# Altium schematic sheet Sensors and Actuators.SchDoc: Sensors and Actuators
size Letter; Author: Alfredo Cortellini; Organization: IT Logic; Address1: 5753 Highway 85 N; Address2: Crestview, FL 32536; Address3: United States; DocumentNumber: 5; SheetNumber: 5; SheetTotal: 6; Email: pcb-design@itlogic.cloud
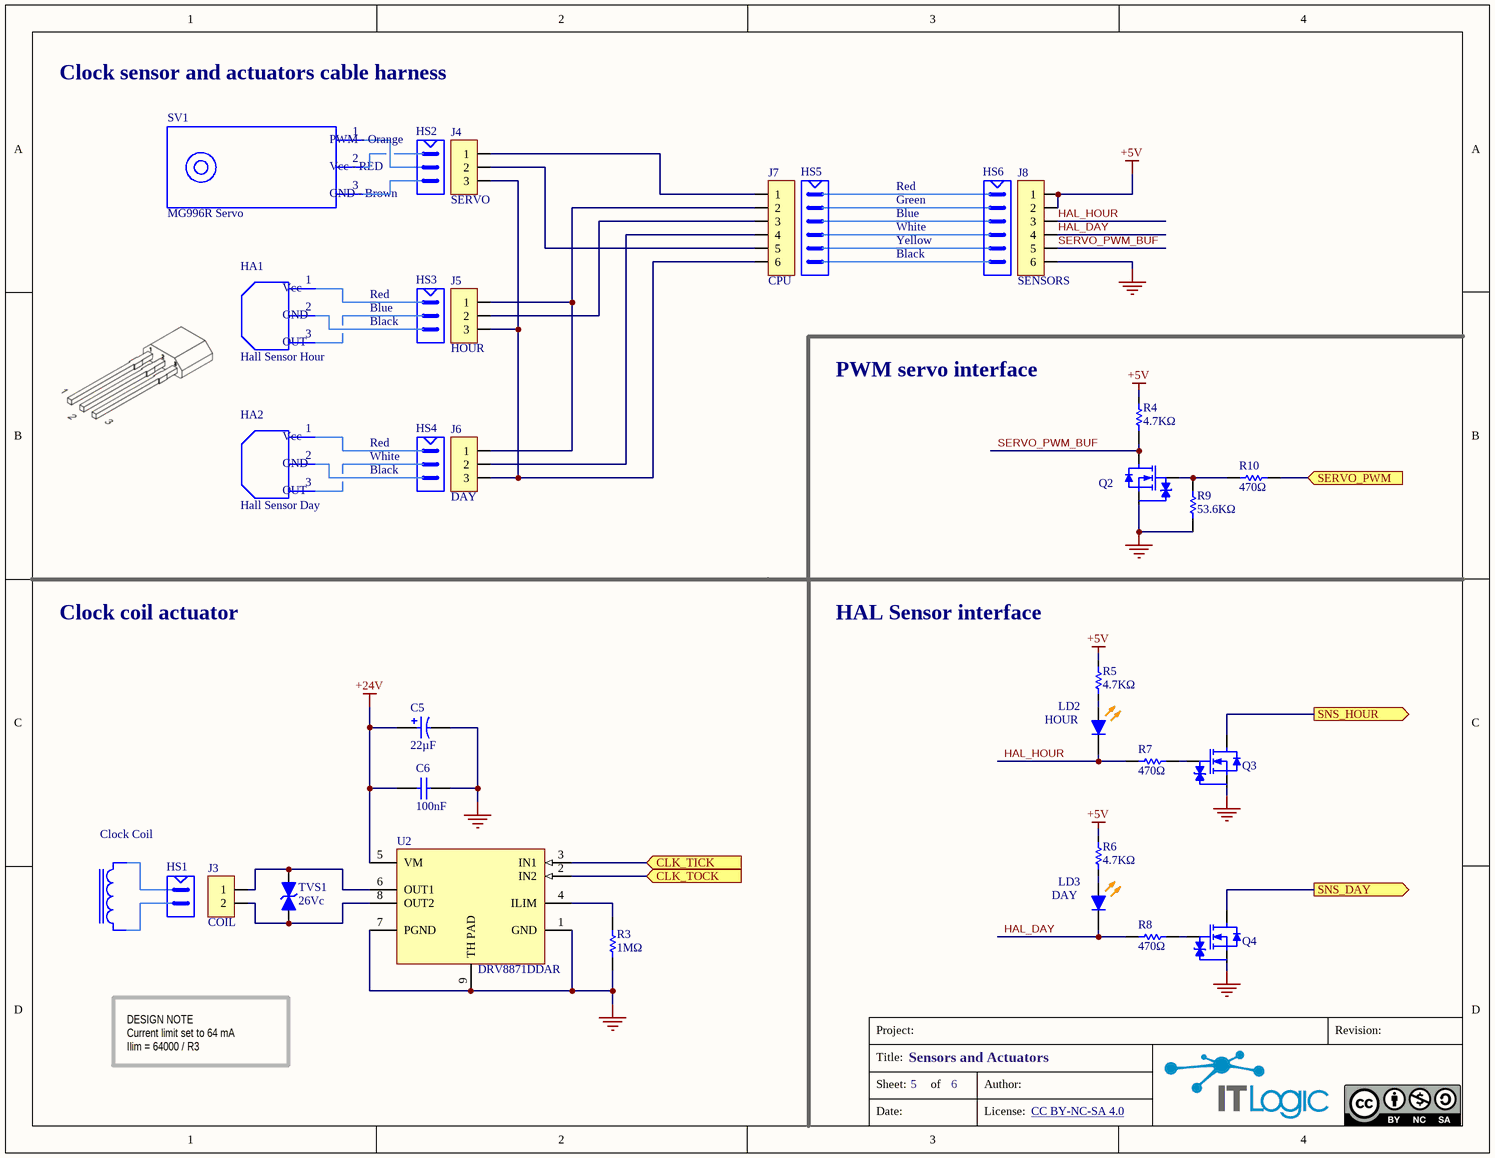
[diagram p0: Sensors and Actuators.SchDoc]

## Parts
C5  22µF  [C-AE-C6-H60]
C6  100nF  [C0603-H90]
HA1  Hall Sensor Hour  (mechanical)
HA2  Hall Sensor Day  (mechanical)
HS1  XHP-2  (value not drawn)  (mechanical)
HS2  XHP-3  (value not drawn)  (mechanical)
HS3  XHP-3  (value not drawn)  (mechanical)
HS4  XHP-3  (value not drawn)  (mechanical)
HS5  XHP-6  (value not drawn)  (mechanical)
HS6  XHP-6  (value not drawn)  (mechanical)
J3  COIL  [JST B2B-XH-A]
J4  SERVO  [JST B3B-XH-A]
J5  HOUR  [JST B3B-XH-A]
J6  DAY  [JST B3B-XH-A]
J7  CPU  [JST B6B-XH-A]
J8  SENSORS  [JST B6B-XH-A]
LD2  HOUR  [LED-0805-O]
LD3  DAY  [LED-0805-O]
Q2  BSS138K-13  [SOT-23]  (value not drawn)
Q3  BSS138K-13  [SOT-23]  (value not drawn)
Q4  BSS138K-13  [SOT-23]  (value not drawn)
R3  1MΩ  [R0603-H55]
R4  4.7KΩ  [R0603-H55]
R5  4.7KΩ  [R0603-H55]
R6  4.7KΩ  [R0603-H55]
R7  470Ω  [R0603-H55]
R8  470Ω  [R0603-H55]
R9  53.6KΩ  [R0603-H55]
R10  470Ω  [R0603-H55]
SV1  MG996R Servo  (mechanical)
TF1  SXH-001T-P0.6  (value not drawn)  (mechanical)
TF2  SXH-001T-P0.6  (value not drawn)  (mechanical)
TF3  SXH-001T-P0.6  (value not drawn)  (mechanical)
TF4  SXH-001T-P0.6  (value not drawn)  (mechanical)
TF5  SXH-001T-P0.6  (value not drawn)  (mechanical)
TF6  SXH-001T-P0.6  (value not drawn)  (mechanical)
TF7  SXH-001T-P0.6  (value not drawn)  (mechanical)
TF8  SXH-001T-P0.6  (value not drawn)  (mechanical)
TF9  SXH-001T-P0.6  (value not drawn)  (mechanical)
TF10  SXH-001T-P0.6  (value not drawn)  (mechanical)
TF11  SXH-001T-P0.6  (value not drawn)  (mechanical)
TF12  SXH-001T-P0.6  (value not drawn)  (mechanical)
TF13  SXH-001T-P0.6  (value not drawn)  (mechanical)
TF14  SXH-001T-P0.6  (value not drawn)  (mechanical)
TF15  SXH-001T-P0.6  (value not drawn)  (mechanical)
TF16  SXH-001T-P0.6  (value not drawn)  (mechanical)
TF17  SXH-001T-P0.6  (value not drawn)  (mechanical)
TF18  SXH-001T-P0.6  (value not drawn)  (mechanical)
TF19  SXH-001T-P0.6  (value not drawn)  (mechanical)
TF20  SXH-001T-P0.6  (value not drawn)  (mechanical)
TF21  SXH-001T-P0.6  (value not drawn)  (mechanical)
TF22  SXH-001T-P0.6  (value not drawn)  (mechanical)
TF23  SXH-001T-P0.6  (value not drawn)  (mechanical)
TVS1  26Vc  [DO-214AC-SMA-NO POL]
U2  DRV8871DDAR  [SOIC-8-N-HT]

## Ports
CLK_TICK (in), CLK_TOCK (in), SERVO_PWM (in), SNS_DAY (out), SNS_HOUR (out)

## Nets
+5V: J8.1 J8.2 R4.2 R5.2 R6.2
+24V: C5.1 C6.1 U2.5(VM)
GND: C5.2 C6.2 J8.6 Q2.2(S) Q3.2(S) Q4.2(S) R3.1 R9.1 U2.1(GND) U2.7(PGND) U2.9(TH_PAD)
CLK_TICK: U2.3(IN1) ; port CLK_TICK
CLK_TOCK: U2.2(IN2) ; port CLK_TOCK
HAL_DAY: J8.4 LD3.1(K) R8.1
HAL_HOUR: J8.3 LD2.1(K) R7.1
SERVO_PWM: R10.2 ; port SERVO_PWM
SERVO_PWM_BUF: J8.5 Q2.3(D) R4.1
SNS_DAY: Q4.3(D) ; port SNS_DAY
SNS_HOUR: Q3.3(D) ; port SNS_HOUR
NetJ3_1: J3.1 TVS1.2 U2.6(OUT1)
NetJ3_2: J3.2 TVS1.1 U2.8(OUT2)
NetJ4_1: J4.1 J7.1
NetJ4_2: J4.2 J7.5
NetJ4_3: J4.3 J5.3 J6.3 J7.6
NetJ5_1: J5.1 J6.1 J7.2
NetJ5_2: J5.2 J7.3
NetJ6_2: J6.2 J7.4
NetLD2_2: LD2.2(A) R5.1
NetLD3_2: LD3.2(A) R6.1
NetQ2_1: Q2.1(G) R9.2 R10.1
NetQ3_1: Q3.1(G) R7.2
NetQ4_1: Q4.1(G) R8.2
NetR3_2: R3.2 U2.4(ILIM)

## Notes on the sheet
- Clock sensor and actuators cable harness
- Blue
- Red
- Green
- White
- Black
- Yellow
- PWM servo interface
- Clock coil actuator
- HAL Sensor interface
- Clock Coil
- DESIGN NOTE
  Current limit set to 64 mA
  Ilim = 64000 / R3
- Project:
- Revision:
- Title:
- Sheet:
- of
- Author:
- Date:
- License:
- CC BY-NC-SA 4.0 <https://creativecommons.org/licenses/by-nc-sa/4.0/>
- (in symbol DRV5023AJQLPG_MEC) 1; Vcc; 2; GND; 3; OUT
- (in symbol MG996R) 1; PWM - Orange; 2; Vcc - RED; 3; GND - Brown

## Library data of the parts
C5 = EEE-FK1H220P: Cap Electrolytic Alu 22uF 50V 20% 165mA 2000h 105C Automotive, Case D; Manufacturer: Panasonic; Resistance: 0.88R; Value: 22u; Manufacturer Part Number: EEE-FK1H220P; Mount: Surface Mount; Capacitance: 22uF; Voltage Rating: 50V; ComponentLink1URL: https://datasheet.ciiva.com/3773/41677623s8437994n1386-3773397.pdf; ComponentLink1Description: Data Sheet; Case: D
C6 = CGA3E2X7R1H104K080AA: Cap 0603 Case Ceramic 100nF 50V X7R; Manufacturer: TDK; Value: 100n; Manufacturer Part Number: CGA3E2X7R1H104K080AA; Mount: Surface Mount; Case: 0603; Capacitance: 100nF; Dielectric: X7R; Voltage Rating: 50V; ComponentLink1URL: https://product.tdk.com/system/files/dam/doc/product/capacitor/ceramic/mlcc/catalog/mlcc_commercial_general_en.pdf; ComponentLink1Description: Data Sheet
HA1 HA2 = DRV5023AJQLPG_MEC: Hall Effect/Magnetic Sensors 2.5 to 38 V 3-TO-92; Manufacturer: Texas Instruments; Manufacturer Part Number: DRV5023AJQLPG; Case: TO-92; ComponentLink1URL: https://www.ti.com/lit/ds/symlink/drv5023.pdf?ts=1619282643269&ref_url=https%253A%252F%252Fwww.ti.com%252Fsensors%252Fmagnetic-sensors%252Fhall-effect-latches-switches%252Fproducts.html; ComponentLink1Description: Data Sheet; Mount: Through Hole
HS1 = XHP-2: Conn Crimp Housing, Series JST XH, 2 Circuits; Current Rating: 3A; Voltage Rating: 250V; Manufacturer: JST; Manufacturer Part Number: XHP-2; Mount: Free Hanging; ComponentLink1URL: https://www.mouser.com/datasheet/2/276/0050579404_CRIMP_HOUSINGS-160468.pdf; ComponentLink1Description: Data Sheet
HS2-HS4 = XHP-3: Conn Crimp Housing, Series JST XH, 3 Circuits; Current Rating: 3A; Voltage Rating: 250V; Manufacturer: JST; Manufacturer Part Number: XHP-3; Mount: Free Hanging; ComponentLink1URL: https://www.mouser.com/datasheet/2/276/0050579404_CRIMP_HOUSINGS-160468.pdf; ComponentLink1Description: Data Sheet
HS5 HS6 = XHP-6: Conn Crimp Housing, Series JST XH, 6 Circuits; Current Rating: 3A; Voltage Rating: 250V; Manufacturer: JST; Manufacturer Part Number: XHP-6; Mount: Free Hanging; ComponentLink1URL: https://www.mouser.com/datasheet/2/276/0050579404_CRIMP_HOUSINGS-160468.pdf; ComponentLink1Description: Data Sheet
J3 = B2B-XH-A(LF)(SN): Conn Shrouded, Series JST XH, 2 Pos Header,(2.50mm) Through Hole, Vertical Tin; Current Rating: 3A; Voltage Rating: 250V; Manufacturer: JST; Manufacturer Part Number: B2B-XH-A(LF)(SN); Mount: Through Hole; ComponentLink1URL: https://datasheet.ciiva.com/726/exh-726400.pdf; ComponentLink1Description: Data Sheet
J4-J6 = B3B-XH-A(LF)(SN): Conn Shrouded, Series JST XH, 3 Pos Header,(2.50mm) Through Hole, Vertical Tin; Current Rating: 3A; Voltage Rating: 250V; Manufacturer: JST; Manufacturer Part Number: B3B-XH-A(LF)(SN); Mount: Through Hole; ComponentLink1URL: https://datasheet.ciiva.com/726/exh-726400.pdf; ComponentLink1Description: Data Sheet
J7 J8 = B6B-XH-A(LF)(SN): Conn Shrouded, Series JST XH, 6 Pos Header, (2.50mm) Through Hole, Vertical Tin; Current Rating: 3A; Voltage Rating: 250V; Manufacturer: JST; Manufacturer Part Number: B6B-XH-A(LF)(SN); Mount: Through Hole; ComponentLink1URL: https://datasheet.ciiva.com/726/exh-726400.pdf; ComponentLink1Description: Data Sheet
LD2 LD3 = LTST-C170KFKT: LED 0805 Top Orange 605nm 2-Pin; Manufacturer: Vishay Lite-On; Manufacturer Part Number: LTST-C170KFKT; Mount: Surface Mount; Case: 0805; ComponentLink1URL: https://www.mouser.com/datasheet/2/239/Lite-On-LTST-C170KFKT-1175423.pdf; ComponentLink1Description: Data Sheet
Q2-Q4 = BSS138K-13: Mosfet N 50V Vds 20V Vgs ESD 1.4R SOT-23; Manufacturer: Diodes; Manufacturer Part Number: BSS138K-13; Mount: Surface Mount; Case: SOT-23; ComponentLink1Description: Data Sheet; ComponentLink1URL: https://www.diodes.com/assets/Datasheets/BSS138K.pdf
R3 = RC0603FR-071ML: Resistor 0603 Case 1MR 1% 1/10W; Manufacturer: Yageo; Voltage Rating: 150V; Value: 1M; Manufacturer Part Number: RC0603FR-071ML; Case: 0603; Resistance: 1MR; ComponentLink1URL: https://datasheet.ciiva.com/2519/pyu-r-int-thick-7-2519712.pdf; ComponentLink1Description: Data Sheet; Mount: Surface Mount
R4-R6 = RC0603FR-074K7L: Resistor 0603 Case 4.7KR 1% 1/10W; Manufacturer: Yageo; Voltage Rating: 150V; Value: 4.7K; Manufacturer Part Number: RC0603FR-074K7L; Case: 0603; Resistance: 4.7kR; ComponentLink1URL: https://datasheet.ciiva.com/11808/0900766b8106beab-11808155.pdf; ComponentLink1Description: Data Sheet; Mount: Surface Mount
R7 R8 R10 = RC0603FR-07470RL: Resistor 0603 Case 470R 1% 1/10W; Manufacturer: Yageo; Voltage Rating: 150V; Value: 470; Manufacturer Part Number: RC0603FR-07470RL; Case: 0603; Resistance: 470R; ComponentLink1URL: https://datasheet.ciiva.com/11808/0900766b8106beab-11808155.pdf; ComponentLink1Description: Data Sheet; Mount: Surface Mount
R9 = RC0603FR-0753K6L: Resistor 0603 Case 53.6KR 1% 1/10W; Manufacturer: Yageo; Voltage Rating: 150V; Value: 53.6K; Manufacturer Part Number: RC0603FR-0753K6L; Case: 0603; Resistance: 53.6kR; ComponentLink1URL: https://datasheet.ciiva.com/2457/pyu-r-int-thick-7-2457521.pdf; ComponentLink1Description: Data Sheet; Mount: Surface Mount
SV1 = MG996R: Servo, High Torque, Metal Gear, Dual Ball Bearing, 120 Gegrees, Stall torque: 9.4 kgf·cm (4.8V),; Manufacturer: Jajadeal; Voltage Rating: 3V; Manufacturer Part Number: MG996R; Mount: Free Hanging; ComponentLink1URL: https://datasheetspdf.com/pdf-file/942981/ETC/MG996R/1; ComponentLink1Description: Data Sheet
TF1-TF23 = SXH-001T-P0.6: Crimp Terminal, Series JST XH, Female, 22-28 AWG,; Current Rating: 3A; Voltage Rating: 250V; Manufacturer: JST; Manufacturer Part Number: SXH-001T-P0.6; Mount: Free Hanging; ComponentLink1URL: https://datasheet.ciiva.com/726/exh-726400.pdf; ComponentLink1Description: Data Sheet
TVS1 = SMAJ26CA: TVS Diode Bidirectional 26Vs, 42.1Vc, 9.5 Amp, SMA; Manufacturer: Littelfuse; Manufacturer Part Number: SMAJ26CA; Mount: Surface Mount; ComponentLink1URL: https://datasheet.ciiva.com/332/littelfuse-tvs-diode-smdj-datasheet-pdf-332997.pdf; ComponentLink1Description: Data Sheet; Case: SMA
U2 = DRV8871DDAR: Motor Driver H-bridge 45V, 3.6A, Integrated current sensing SOIC-8 PowerPAD -40 to 125; Manufacturer: Texas Instruments; Manufacturer Part Number: DRV8871DDAR; Mount: Surface Mount; Case: SOIC-8; ComponentLink1URL: https://www.ti.com/lit/ds/symlink/drv8871.pdf?HQS=dis-mous-null-mousermode-dsf-pf-null-wwe&ts=1619428375041&ref_url=https%253A%252F%252Fwww.mouser.it%252F; ComponentLink1Description: Data Sheet